# Altium schematic sheet LJ_Mosfet_Power.SchDoc
size 508 x 508 mm
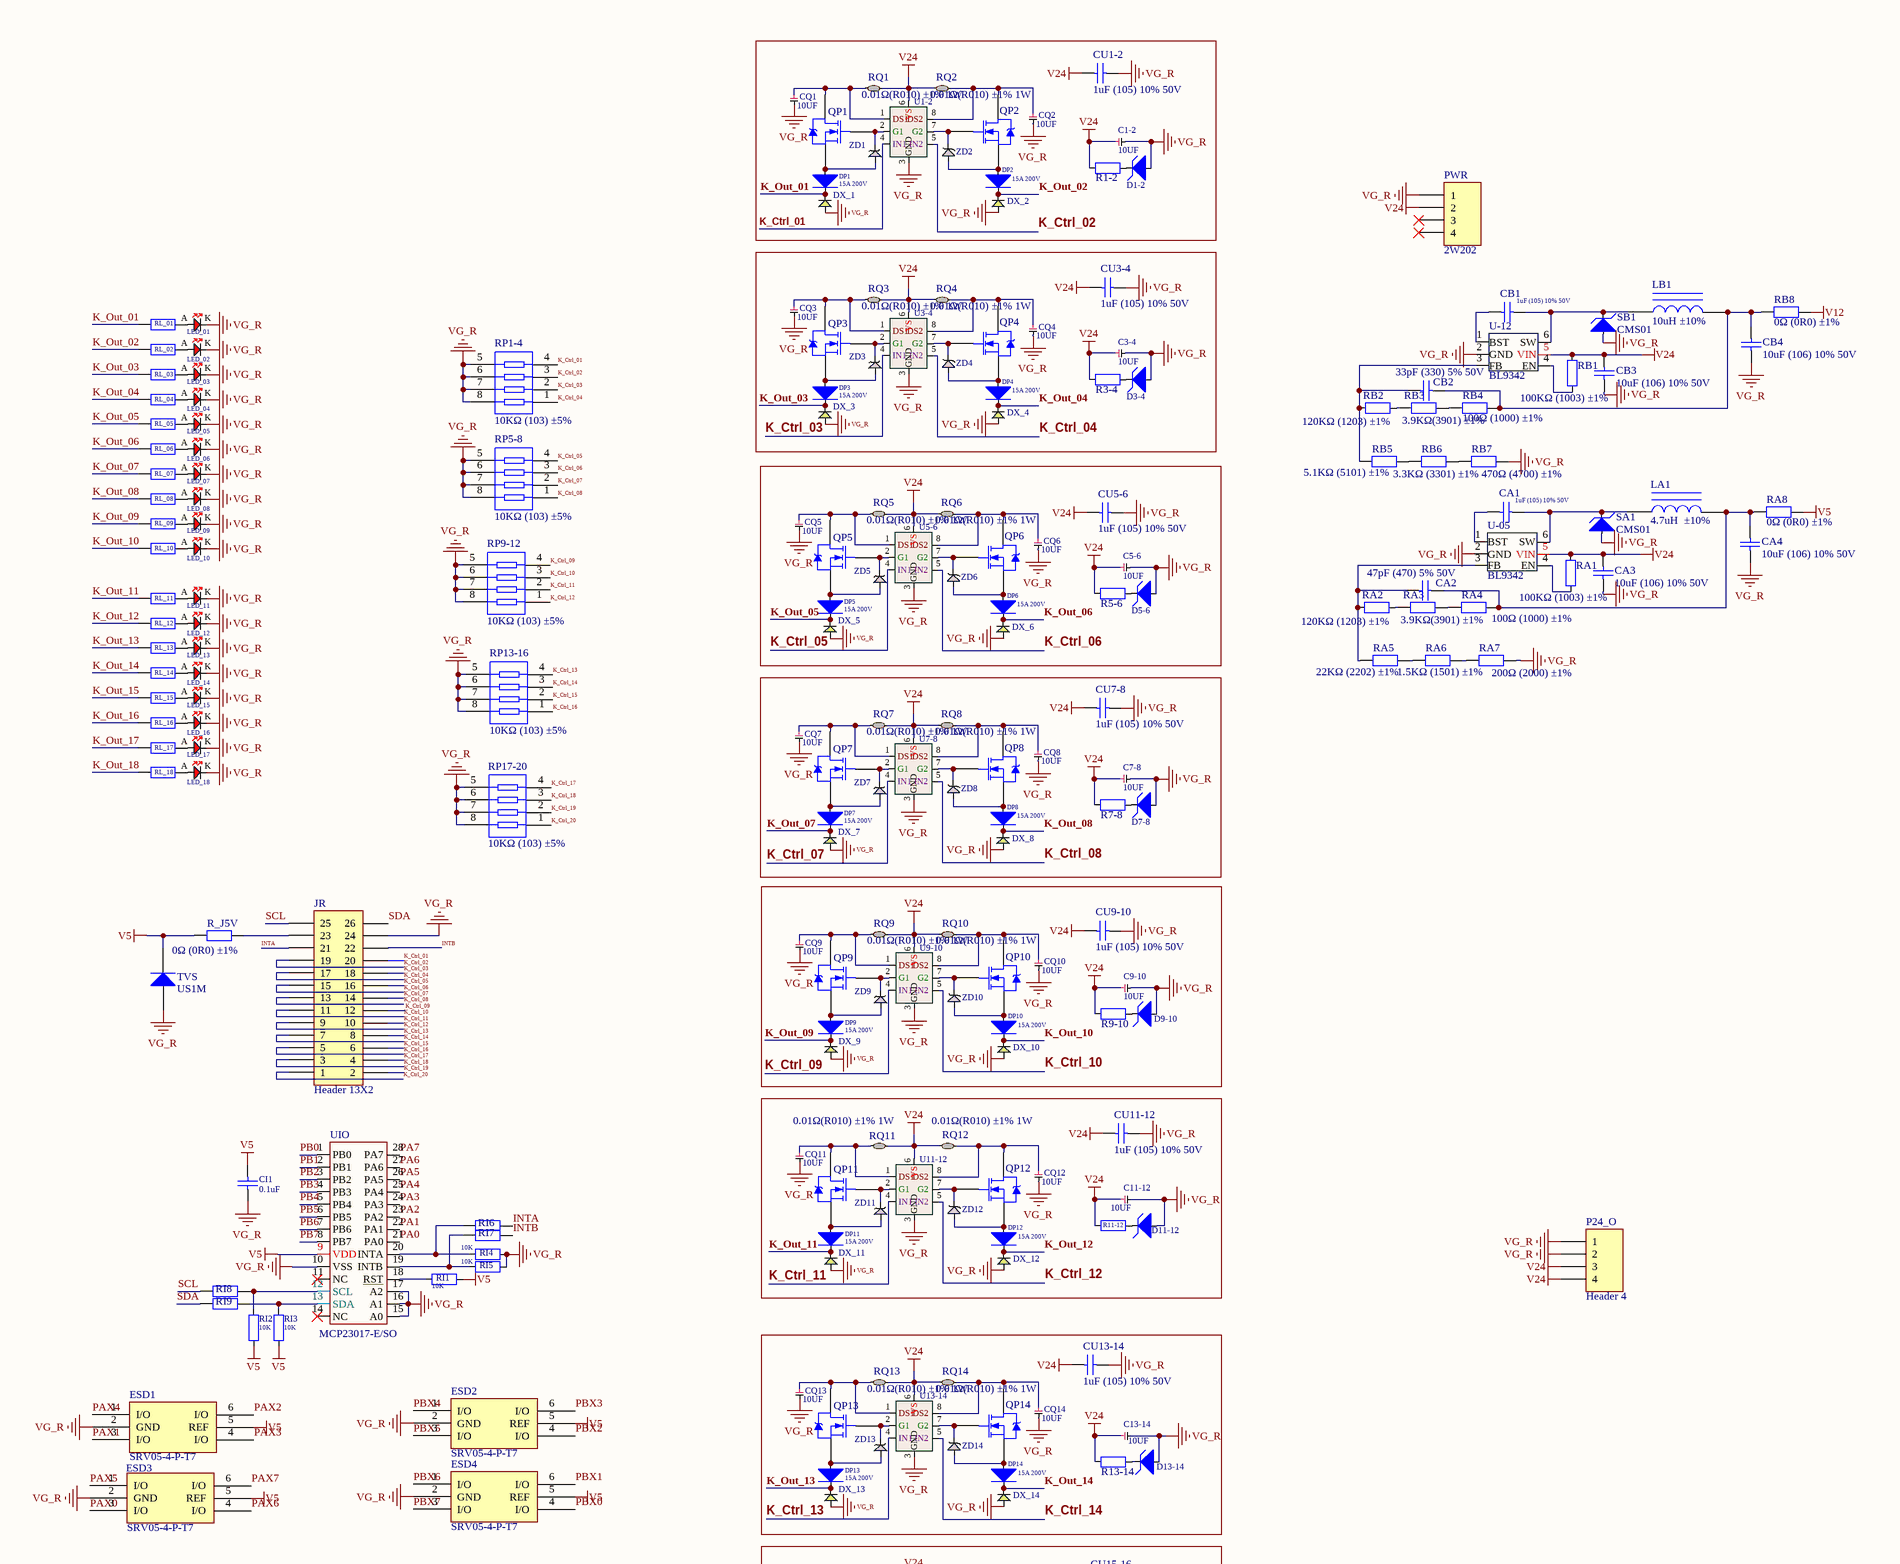
[diagram p0: LJ_Mosfet_Power.SchDoc, top left]
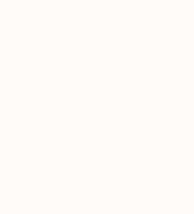
[diagram p1: LJ_Mosfet_Power.SchDoc, top right]
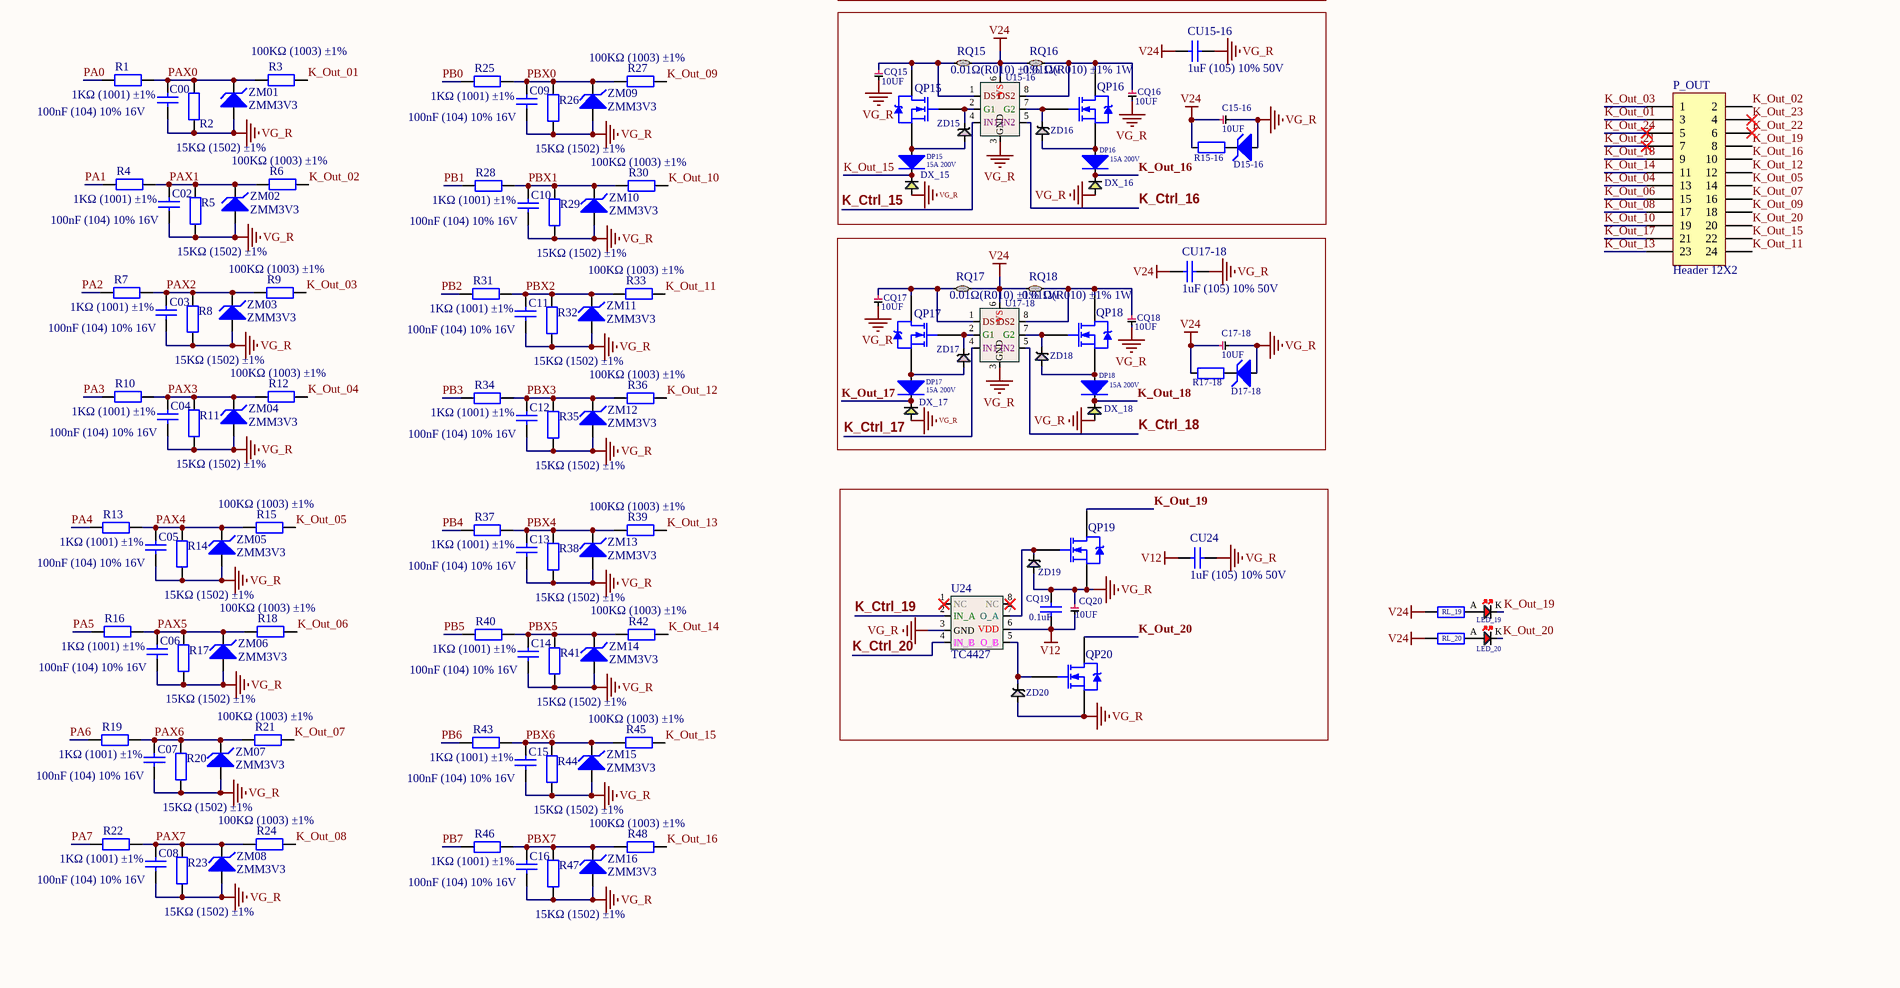
[diagram p2: LJ_Mosfet_Power.SchDoc, bottom left]
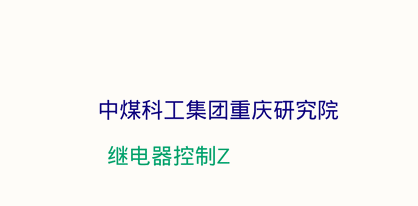
[diagram p3: LJ_Mosfet_Power.SchDoc, bottom right]

## Parts
C00  100nF (104) 10% 16V  [0402_C]
C1-2  10UF  [C1210]
C02  100nF (104) 10% 16V  [0402_C]
C03  100nF (104) 10% 16V  [0402_C]
C3-4  10UF  [C1210]
C04  100nF (104) 10% 16V  [0402_C]
C05  100nF (104) 10% 16V  [0402_C]
C5-6  10UF  [C1210]
C06  100nF (104) 10% 16V  [0402_C]
C07  100nF (104) 10% 16V  [0402_C]
C7-8  10UF  [C1210]
C08  100nF (104) 10% 16V  [0402_C]
C09  100nF (104) 10% 16V  [0402_C]
C9-10  10UF  [C1210]
C10  100nF (104) 10% 16V  [0402_C]
C11  100nF (104) 10% 16V  [0402_C]
C11-12  10UF  [C1210]
C12  100nF (104) 10% 16V  [0402_C]
C13  100nF (104) 10% 16V  [0402_C]
C13-14  10UF  [C1210]
C14  100nF (104) 10% 16V  [0402_C]
C15  100nF (104) 10% 16V  [0402_C]
C15-16  10UF  [C1210]
C16  100nF (104) 10% 16V  [0402_C]
C17-18  10UF  [C1210]
CA1  1uF (105) 10% 50V  [0603_C]
CA2  47pF (470) 5% 50V  [0402_C]
CA3  10uF (106) 10% 50V  [1206_C]
CA4  10uF (106) 10% 50V  [1206_C]
CB1  1uF (105) 10% 50V  [0603_C]
CB2  33pF (330) 5% 50V  [0402_C]
CB3  10uF (106) 10% 50V  [1206_C]
CB4  10uF (106) 10% 50V  [1206_C]
CI1  VAL: 0.1uF  [0603_C]  (hidden comment: 100nF (104) 10% 50V)
CQ1  10UF  [C1210]
CQ2  10UF  [C1210]
CQ3  10UF  [C1210]
CQ4  10UF  [C1210]
CQ5  10UF  [C1210]
CQ6  10UF  [C1210]
CQ7  10UF  [C1210]
CQ8  10UF  [C1210]
CQ9  10UF  [C1210]
CQ10  10UF  [C1210]
CQ11  10UF  [C1210]
CQ12  10UF  [C1210]
CQ13  10UF  [C1210]
CQ14  10UF  [C1210]
CQ15  10UF  [C1210]
CQ16  10UF  [C1210]
CQ17  10UF  [C1210]
CQ18  10UF  [C1210]
CQ19  VAL: 0.1uF  [0603_C]  (hidden comment: 100nF (104) 10% 50V)
CQ20  10UF  [C1210]
CU1-2  1uF (105) 10% 50V  [0805_C]
CU3-4  1uF (105) 10% 50V  [0805_C]
CU5-6  1uF (105) 10% 50V  [0805_C]
CU7-8  1uF (105) 10% 50V  [0805_C]
CU9-10  1uF (105) 10% 50V  [0805_C]
CU11-12  1uF (105) 10% 50V  [0805_C]
CU13-14  1uF (105) 10% 50V  [0805_C]
CU15-16  1uF (105) 10% 50V  [0805_C]
CU17-18  1uF (105) 10% 50V  [0805_C]
CU24  1uF (105) 10% 50V  [0805_C]
D1-2  ZMM5255B  [LL-34]  (value not drawn)
D3-4  ZMM5255B  [LL-34]  (value not drawn)
D5-6  ZMM5255B  [LL-34]  (value not drawn)
D7-8  ZMM5255B  [LL-34]  (value not drawn)
D9-10  ZMM5255B  [LL-34]  (value not drawn)
D11-12  ZMM5255B  [LL-34]  (value not drawn)
D13-14  ZMM5255B  [LL-34]  (value not drawn)
D15-16  ZMM5255B  [LL-34]  (value not drawn)
D17-18  ZMM5255B  [LL-34]  (value not drawn)
DP1  15A 200V  [TO-277B]
DP2  15A 200V  [TO-277B]
DP3  15A 200V  [TO-277B]
DP4  15A 200V  [TO-277B]
DP5  15A 200V  [TO-277B]
DP6  15A 200V  [TO-277B]
DP7  15A 200V  [TO-277B]
DP8  15A 200V  [TO-277B]
DP9  15A 200V  [TO-277B]
DP10  15A 200V  [TO-277B]
DP11  15A 200V  [TO-277B]
DP12  15A 200V  [TO-277B]
DP13  15A 200V  [TO-277B]
DP14  15A 200V  [TO-277B]
DP15  15A 200V  [TO-277B]
DP16  15A 200V  [TO-277B]
DP17  15A 200V  [TO-277B]
DP18  15A 200V  [TO-277B]
DX_1  US5M  [SMC]  (value not drawn)
DX_2  US5M  [SMC]  (value not drawn)
DX_3  US5M  [SMC]  (value not drawn)
DX_4  US5M  [SMC]  (value not drawn)
DX_5  US5M  [SMC]  (value not drawn)
DX_6  US5M  [SMC]  (value not drawn)
DX_7  US5M  [SMC]  (value not drawn)
DX_8  US5M  [SMC]  (value not drawn)
DX_9  US5M  [SMC]  (value not drawn)
DX_10  US5M  [SMC]  (value not drawn)
DX_11  US5M  [SMC]  (value not drawn)
DX_12  US5M  [SMC]  (value not drawn)
DX_13  US5M  [SMC]  (value not drawn)
DX_14  US5M  [SMC]  (value not drawn)
DX_15  US5M  [SMC]  (value not drawn)
DX_16  US5M  [SMC]  (value not drawn)
DX_17  US5M  [SMC]  (value not drawn)
DX_18  US5M  [SMC]  (value not drawn)
ESD1  SRV05-4-P-T7  [SOT23-6]
ESD2  SRV05-4-P-T7  [SOT23-6]
ESD3  SRV05-4-P-T7  [SOT23-6]
ESD4  SRV05-4-P-T7  [SOT23-6]
JR  Header 13X2  [FKV26HR]
LA1  4.7uH  ±10%  [1206_L]
LB1  10uH ±10%  [1206_L]
LED_01  红灯 0603  [0603_LED_S1]  (value not drawn)
LED_02  红灯 0603  [0603_LED_S1]  (value not drawn)
LED_03  红灯 0603  [0603_LED_S1]  (value not drawn)
LED_04  红灯 0603  [0603_LED_S1]  (value not drawn)
LED_05  红灯 0603  [0603_LED_S1]  (value not drawn)
LED_06  红灯 0603  [0603_LED_S1]  (value not drawn)
LED_07  红灯 0603  [0603_LED_S1]  (value not drawn)
LED_08  红灯 0603  [0603_LED_S1]  (value not drawn)
LED_09  红灯 0603  [0603_LED_S1]  (value not drawn)
LED_10  红灯 0603  [0603_LED_S1]  (value not drawn)
LED_11  红灯 0603  [0603_LED_S1]  (value not drawn)
LED_12  红灯 0603  [0603_LED_S1]  (value not drawn)
LED_13  红灯 0603  [0603_LED_S1]  (value not drawn)
LED_14  红灯 0603  [0603_LED_S1]  (value not drawn)
LED_15  红灯 0603  [0603_LED_S1]  (value not drawn)
LED_16  红灯 0603  [0603_LED_S1]  (value not drawn)
LED_17  红灯 0603  [0603_LED_S1]  (value not drawn)
LED_18  红灯 0603  [0603_LED_S1]  (value not drawn)
LED_19  红灯 0603  [0603_LED_S1]  (value not drawn)
LED_20  红灯 0603  [0603_LED_S1]  (value not drawn)
P24_O  Header 4  [KF235-5.0-4P]
P_OUT  Header 12X2  [5569_24P]
PWR  2W202  [2W2公90度带支架锁螺丝]
QP1  STB120NF10  [DPAK2 /to263]  (value not drawn)
QP2  STB120NF10  [DPAK2 /to263]  (value not drawn)
QP3  STB120NF10  [DPAK2 /to263]  (value not drawn)
QP4  STB120NF10  [DPAK2 /to263]  (value not drawn)
QP5  STB120NF10  [DPAK2 /to263]  (value not drawn)
QP6  STB120NF10  [DPAK2 /to263]  (value not drawn)
QP7  STB120NF10  [DPAK2 /to263]  (value not drawn)
QP8  STB120NF10  [DPAK2 /to263]  (value not drawn)
QP9  STB120NF10  [DPAK2 /to263]  (value not drawn)
QP10  STB120NF10  [DPAK2 /to263]  (value not drawn)
QP11  STB120NF10  [DPAK2 /to263]  (value not drawn)
QP12  STB120NF10  [DPAK2 /to263]  (value not drawn)
QP13  STB120NF10  [DPAK2 /to263]  (value not drawn)
QP14  STB120NF10  [DPAK2 /to263]  (value not drawn)
QP15  STB120NF10  [DPAK2 /to263]  (value not drawn)
QP16  STB120NF10  [DPAK2 /to263]  (value not drawn)
QP17  STB120NF10  [DPAK2 /to263]  (value not drawn)
QP18  STB120NF10  [DPAK2 /to263]  (value not drawn)
QP19  STB120NF10  [DPAK2 /to263]  (value not drawn)
QP20  STB120NF10  [DPAK2 /to263]  (value not drawn)
R1  1KΩ (1001) ±1%  [0402_R]
R1-2  1KΩ (1001) ±1%  [0805_R]  (value not drawn)
R2  15KΩ (1502) ±1%  [0402_R]
R3  100KΩ (1003) ±1%  [0402_R]
R3-4  1KΩ (1001) ±1%  [0805_R]  (value not drawn)
R4  1KΩ (1001) ±1%  [0402_R]
R5  15KΩ (1502) ±1%  [0402_R]
R5-6  1KΩ (1001) ±1%  [0805_R]  (value not drawn)
R6  100KΩ (1003) ±1%  [0402_R]
R7  1KΩ (1001) ±1%  [0402_R]
R7-8  1KΩ (1001) ±1%  [0805_R]  (value not drawn)
R8  15KΩ (1502) ±1%  [0402_R]
R9  100KΩ (1003) ±1%  [0402_R]
R9-10  1KΩ (1001) ±1%  [0805_R]  (value not drawn)
R10  1KΩ (1001) ±1%  [0402_R]
R11  15KΩ (1502) ±1%  [0402_R]
R11-12  1KΩ (1001) ±1%  [0805_R]  (value not drawn)
R12  100KΩ (1003) ±1%  [0402_R]
R13  1KΩ (1001) ±1%  [0402_R]
R13-14  1KΩ (1001) ±1%  [0805_R]  (value not drawn)
R14  15KΩ (1502) ±1%  [0402_R]
R15  100KΩ (1003) ±1%  [0402_R]
R15-16  1KΩ (1001) ±1%  [0805_R]  (value not drawn)
R16  1KΩ (1001) ±1%  [0402_R]
R17  15KΩ (1502) ±1%  [0402_R]
R17-18  1KΩ (1001) ±1%  [0805_R]  (value not drawn)
R18  100KΩ (1003) ±1%  [0402_R]
R19  1KΩ (1001) ±1%  [0402_R]
R20  15KΩ (1502) ±1%  [0402_R]
R21  100KΩ (1003) ±1%  [0402_R]
R22  1KΩ (1001) ±1%  [0402_R]
R23  15KΩ (1502) ±1%  [0402_R]
R24  100KΩ (1003) ±1%  [0402_R]
R25  1KΩ (1001) ±1%  [0402_R]
R26  15KΩ (1502) ±1%  [0402_R]
R27  100KΩ (1003) ±1%  [0402_R]
R28  1KΩ (1001) ±1%  [0402_R]
R29  15KΩ (1502) ±1%  [0402_R]
R30  100KΩ (1003) ±1%  [0402_R]
R31  1KΩ (1001) ±1%  [0402_R]
R32  15KΩ (1502) ±1%  [0402_R]
R33  100KΩ (1003) ±1%  [0402_R]
R34  1KΩ (1001) ±1%  [0402_R]
R35  15KΩ (1502) ±1%  [0402_R]
R36  100KΩ (1003) ±1%  [0402_R]
R37  1KΩ (1001) ±1%  [0402_R]
R38  15KΩ (1502) ±1%  [0402_R]
R39  100KΩ (1003) ±1%  [0402_R]
R40  1KΩ (1001) ±1%  [0402_R]
R41  15KΩ (1502) ±1%  [0402_R]
R42  100KΩ (1003) ±1%  [0402_R]
R43  1KΩ (1001) ±1%  [0402_R]
R44  15KΩ (1502) ±1%  [0402_R]
R45  100KΩ (1003) ±1%  [0402_R]
R46  1KΩ (1001) ±1%  [0402_R]
R47  15KΩ (1502) ±1%  [0402_R]
R48  100KΩ (1003) ±1%  [0402_R]
R_J5V  0Ω (0R0) ±1%  [0805_R]
RA1  100KΩ (1003) ±1%  [0402_R]
RA2  120KΩ (1203) ±1%  [0402_R]
RA3  3.9KΩ(3901) ±1%  [0402_R]
RA4  100Ω (1000) ±1%  [0402_R]
RA5  22KΩ (2202) ±1%  [0402_R]
RA6  1.5KΩ (1501) ±1%  [0402_R]
RA7  200Ω (2000) ±1%  [0402_R]
RA8  0Ω (0R0) ±1%  [0805_R]
RB1  100KΩ (1003) ±1%  [0402_R]
RB2  120KΩ (1203) ±1%  [0402_R]
RB3  3.9KΩ(3901) ±1%  [0402_R]
RB4  100Ω (1000) ±1%  [0402_R]
RB5  5.1KΩ (5101) ±1%  [0402_R]
RB6  3.3KΩ (3301) ±1%  [0402_R]
RB7  470Ω (4700) ±1%  [0402_R]
RB8  0Ω (0R0) ±1%  [0805_R]
RI1  VAL: 10K  [0402_R]  (hidden comment: 10KΩ (1002) ±1%)
RI2  VAL: 10K  [0402_R]  (hidden comment: 10KΩ (1002) ±1%)
RI3  VAL: 10K  [0402_R]  (hidden comment: 10KΩ (1002) ±1%)
RI4  VAL: 10K  [0402_R]  (hidden comment: 10KΩ (1002) ±1%)
RI5  VAL: 10K  [0402_R]  (hidden comment: 10KΩ (1002) ±1%)
RI6  0Ω (0R0) ±1%  [0402_R]  (value not drawn)
RI7  0Ω (0R0) ±1%  [0402_R]  (value not drawn)
RI8  0Ω (0R0) ±1%  [0402_R]  (value not drawn)
RI9  0Ω (0R0) ±1%  [0402_R]  (value not drawn)
RL_01  20KΩ (2002) ±1%  [0603_R]  (value not drawn)
RL_02  20KΩ (2002) ±1%  [0603_R]  (value not drawn)
RL_03  20KΩ (2002) ±1%  [0603_R]  (value not drawn)
RL_04  20KΩ (2002) ±1%  [0603_R]  (value not drawn)
RL_05  20KΩ (2002) ±1%  [0603_R]  (value not drawn)
RL_06  20KΩ (2002) ±1%  [0603_R]  (value not drawn)
RL_07  20KΩ (2002) ±1%  [0603_R]  (value not drawn)
RL_08  20KΩ (2002) ±1%  [0603_R]  (value not drawn)
RL_09  20KΩ (2002) ±1%  [0603_R]  (value not drawn)
RL_10  20KΩ (2002) ±1%  [0603_R]  (value not drawn)
RL_11  20KΩ (2002) ±1%  [0603_R]  (value not drawn)
RL_12  20KΩ (2002) ±1%  [0603_R]  (value not drawn)
RL_13  20KΩ (2002) ±1%  [0603_R]  (value not drawn)
RL_14  20KΩ (2002) ±1%  [0603_R]  (value not drawn)
RL_15  20KΩ (2002) ±1%  [0603_R]  (value not drawn)
RL_16  20KΩ (2002) ±1%  [0603_R]  (value not drawn)
RL_17  20KΩ (2002) ±1%  [0603_R]  (value not drawn)
RL_18  20KΩ (2002) ±1%  [0603_R]  (value not drawn)
RL_19  20KΩ (2002) ±1%  [0603_R]  (value not drawn)
RL_20  20KΩ (2002) ±1%  [0603_R]  (value not drawn)
RP1-4  10KΩ (103) ±5%  [0603_Rx4]
RP5-8  10KΩ (103) ±5%  [0603_Rx4]
RP9-12  10KΩ (103) ±5%  [0603_Rx4]
RP13-16  10KΩ (103) ±5%  [0603_Rx4]
RP17-20  10KΩ (103) ±5%  [0603_Rx4]
RQ1  0.01Ω(R010) ±1% 1W  [R2512]
RQ2  0.01Ω(R010) ±1% 1W  [R2512]
RQ3  0.01Ω(R010) ±1% 1W  [R2512]
RQ4  0.01Ω(R010) ±1% 1W  [R2512]
RQ5  0.01Ω(R010) ±1% 1W  [R2512]
RQ6  0.01Ω(R010) ±1% 1W  [R2512]
RQ7  0.01Ω(R010) ±1% 1W  [R2512]
RQ8  0.01Ω(R010) ±1% 1W  [R2512]
RQ9  0.01Ω(R010) ±1% 1W  [R2512]
RQ10  0.01Ω(R010) ±1% 1W  [R2512]
RQ11  0.01Ω(R010) ±1% 1W  [R2512]
RQ12  0.01Ω(R010) ±1% 1W  [R2512]
RQ13  0.01Ω(R010) ±1% 1W  [R2512]
RQ14  0.01Ω(R010) ±1% 1W  [R2512]
RQ15  0.01Ω(R010) ±1% 1W  [R2512]
RQ16  0.01Ω(R010) ±1% 1W  [R2512]
RQ17  0.01Ω(R010) ±1% 1W  [R2512]
RQ18  0.01Ω(R010) ±1% 1W  [R2512]
SA1  CMS01  [M-FLAT]
SB1  CMS01  [M-FLAT]
TVS  US1M  [SMA(DO-214AC)_S1]
U1-2  LTC1255CS8  [LC-SOIC-8_150mil]  (value not drawn)
U3-4  LTC1255CS8  [LC-SOIC-8_150mil]  (value not drawn)
U5-6  LTC1255CS8  [LC-SOIC-8_150mil]  (value not drawn)
U7-8  LTC1255CS8  [LC-SOIC-8_150mil]  (value not drawn)
U9-10  LTC1255CS8  [LC-SOIC-8_150mil]  (value not drawn)
U11-12  LTC1255CS8  [LC-SOIC-8_150mil]  (value not drawn)
U13-14  LTC1255CS8  [LC-SOIC-8_150mil]  (value not drawn)
U15-16  LTC1255CS8  [LC-SOIC-8_150mil]  (value not drawn)
U17-18  LTC1255CS8  [LC-SOIC-8_150mil]  (value not drawn)
U24  TC4427  [SOIC8]
U-05  BL9342  [SOT23-6]
U-12  BL9342  [SOT23-6]
UIO  MCP23017-E/SO  [SSOP28]
ZD1  LBZT52C12T1G  [SOD123]  (value not drawn)
ZD2  LBZT52C12T1G  [SOD123]  (value not drawn)
ZD3  LBZT52C12T1G  [SOD123]  (value not drawn)
ZD4  LBZT52C12T1G  [SOD123]  (value not drawn)
ZD5  LBZT52C12T1G  [SOD123]  (value not drawn)
ZD6  LBZT52C12T1G  [SOD123]  (value not drawn)
ZD7  LBZT52C12T1G  [SOD123]  (value not drawn)
ZD8  LBZT52C12T1G  [SOD123]  (value not drawn)
ZD9  LBZT52C12T1G  [SOD123]  (value not drawn)
ZD10  LBZT52C12T1G  [SOD123]  (value not drawn)
ZD11  LBZT52C12T1G  [SOD123]  (value not drawn)
ZD12  LBZT52C12T1G  [SOD123]  (value not drawn)
ZD13  LBZT52C12T1G  [SOD123]  (value not drawn)
ZD14  LBZT52C12T1G  [SOD123]  (value not drawn)
ZD15  LBZT52C12T1G  [SOD123]  (value not drawn)
ZD16  LBZT52C12T1G  [SOD123]  (value not drawn)
ZD17  LBZT52C12T1G  [SOD123]  (value not drawn)
ZD18  LBZT52C12T1G  [SOD123]  (value not drawn)
ZD19  LBZT52C12T1G  [SOD123]  (value not drawn)
ZD20  LBZT52C12T1G  [SOD123]  (value not drawn)
ZM01  ZMM3V3  [LL-34]
ZM02  ZMM3V3  [LL-34]
ZM03  ZMM3V3  [LL-34]
ZM04  ZMM3V3  [LL-34]
ZM05  ZMM3V3  [LL-34]
ZM06  ZMM3V3  [LL-34]
ZM07  ZMM3V3  [LL-34]
ZM08  ZMM3V3  [LL-34]
ZM09  ZMM3V3  [LL-34]
ZM10  ZMM3V3  [LL-34]
ZM11  ZMM3V3  [LL-34]
ZM12  ZMM3V3  [LL-34]
ZM13  ZMM3V3  [LL-34]
ZM14  ZMM3V3  [LL-34]
ZM15  ZMM3V3  [LL-34]
ZM16  ZMM3V3  [LL-34]

## Nets
V5: CI1.2 ESD1.5(REF) ESD2.5(REF) ESD3.5(REF) ESD4.5(REF) R_J5V.1 RA8.2 RI1.2 RI2.2 RI3.2 TVS.2(K) UIO.9(VDD)
V12: CQ19.1 CQ20.2 CU24.1 RB8.2 U24.6(VDD)
V24: C1-2.1 C3-4.1 C5-6.1 C7-8.1 C9-10.1 C11-12.1 C13-14.1 C15-16.1 C17-18.1 CA3.2 CB3.2 CU1-2.1 CU3-4.1 CU5-6.1 CU7-8.1 CU9-10.1 CU11-12.1 CU13-14.1 CU15-16.1 CU17-18.1 P24_O.3 P24_O.4 PWR.2 R1-2.1 R3-4.1 R5-6.1 R7-8.1 R9-10.1 R11-12.1 R13-14.1 R15-16.1 R17-18.1 RA1.2 RB1.2 RL_19.2 RL_20.2 RQ1.2 RQ2.1 RQ3.2 RQ4.1 RQ5.2 RQ6.1 RQ7.2 RQ8.1 RQ9.2 RQ10.1 RQ11.2 RQ12.1 RQ13.2 RQ14.1 RQ15.2 RQ16.1 RQ17.2 RQ18.1 U1-2.6(VS) U3-4.6(VS) U5-6.6(VS) U7-8.6(VS) U9-10.6(VS) U11-12.6(VS) U13-14.6(VS) U15-16.6(VS) U17-18.6(VS) U-05.5(VIN) U-12.5(VIN)
VG_R: C00.1 C1-2.2 C02.1 C03.1 C3-4.2 C04.1 C05.1 C5-6.2 C06.1 C07.1 C7-8.2 C08.1 C09.1 C9-10.2 C10.1 C11.1 C11-12.2 C12.1 C13.1 C13-14.2 C14.1 C15.1 C15-16.2 C16.1 C17-18.2 CA3.1 CA4.2 CB3.1 CB4.2 CI1.1 CQ1.2 CQ2.2 CQ3.2 CQ4.2 CQ5.2 CQ6.2 CQ7.2 CQ8.2 CQ9.2 CQ10.2 CQ11.2 CQ12.2 CQ13.2 CQ14.2 CQ15.2 CQ16.2 CQ17.2 CQ18.2 CQ19.2 CQ20.1 CU1-2.2 CU3-4.2 CU5-6.2 CU7-8.2 CU9-10.2 CU11-12.2 CU13-14.2 CU15-16.2 CU17-18.2 CU24.2 D1-2.1(A) D3-4.1(A) D5-6.1(A) D7-8.1(A) D9-10.1(A) D11-12.1(A) D13-14.1(A) D15-16.1(A) D17-18.1(A) DX_1.1 DX_2.1 DX_3.1 DX_4.1 DX_5.1 DX_6.1 DX_7.1 DX_8.1 DX_9.1 DX_10.1 DX_11.1 DX_12.1 DX_13.1 DX_14.1 DX_15.1 DX_16.1 DX_17.1 DX_18.1 ESD1.2(GND) ESD2.2(GND) ESD3.2(GND) ESD4.2(GND) JR.24 LED_01.K LED_02.K LED_03.K LED_04.K LED_05.K LED_06.K LED_07.K LED_08.K LED_09.K LED_10.K LED_11.K LED_12.K LED_13.K LED_14.K LED_15.K LED_16.K LED_17.K LED_18.K P24_O.1 P24_O.2 PWR.1 QP19.3(S) QP20.3(S) R2.1 R5.1 R8.1 R11.1 R14.1 R17.1 R20.1 R23.1 R26.1 R29.1 R32.1 R35.1 R38.1 R41.1 R44.1 R47.1 RA7.2 RB7.2 RI4.2 RI5.2 RP1-4.5 RP1-4.6 RP1-4.7 RP1-4.8 RP5-8.5 RP5-8.6 RP5-8.7 RP5-8.8 RP9-12.5 RP9-12.6 RP9-12.7 RP9-12.8 RP13-16.5 RP13-16.6 RP13-16.7 RP13-16.8 RP17-20.5 RP17-20.6 RP17-20.7 RP17-20.8 SA1.1(A) SB1.1(A) TVS.1(A) U1-2.3(GND) U3-4.3(GND) U5-6.3(GND) U7-8.3(GND) U9-10.3(GND) U11-12.3(GND) U13-14.3(GND) U15-16.3(GND) U17-18.3(GND) U24.3(GND) U-05.2(GND) U-12.2(GND) UIO.10(VSS) UIO.15(A0) UIO.16(A1) UIO.17(A2) ZD19.1 ZD20.1 ZM01.1(A) ZM02.1(A) ZM03.1(A) ZM04.1(A) ZM05.1(A) ZM06.1(A) ZM07.1(A) ZM08.1(A) ZM09.1(A) ZM10.1(A) ZM11.1(A) ZM12.1(A) ZM13.1(A) ZM14.1(A) ZM15.1(A) ZM16.1(A)
INTA: JR.21 RI6.2
INTB: JR.22 RI7.2
K_Ctrl_01: JR.20 RP1-4.4 U1-2.4(IN1)
K_Ctrl_02: JR.19 RP1-4.3 U1-2.5(IN2)
K_Ctrl_03: JR.18 RP1-4.2 U3-4.4(IN1)
K_Ctrl_04: JR.17 RP1-4.1 U3-4.5(IN2)
K_Ctrl_05: JR.16 RP5-8.4 U5-6.4(IN1)
K_Ctrl_06: JR.15 RP5-8.3 U5-6.5(IN2)
K_Ctrl_07: JR.14 RP5-8.2 U7-8.4(IN1)
K_Ctrl_08: JR.13 RP5-8.1 U7-8.5(IN2)
K_Ctrl_09: JR.12 RP9-12.4 U9-10.4(IN1)
K_Ctrl_10: JR.11 RP9-12.3 U9-10.5(IN2)
K_Ctrl_11: JR.10 RP9-12.2 U11-12.4(IN1)
K_Ctrl_12: JR.9 RP9-12.1 U11-12.5(IN2)
K_Ctrl_13: JR.8 RP13-16.4 U13-14.4(IN1)
K_Ctrl_14: JR.7 RP13-16.3 U13-14.5(IN2)
K_Ctrl_15: JR.6 RP13-16.2 U15-16.4(IN1)
K_Ctrl_16: JR.5 RP13-16.1 U15-16.5(IN2)
K_Ctrl_17: JR.4 RP17-20.4 U17-18.4(IN1)
K_Ctrl_18: JR.3 RP17-20.3 U17-18.5(IN2)
K_Ctrl_19: JR.2 RP17-20.2 U24.2(IN_A)
K_Ctrl_20: JR.1 RP17-20.1 U24.4(IN_B)
K_Out_01: DP1.2(K) DX_1.2 P_OUT.3 R3.2 RL_01.2
K_Out_02: DP2.2(K) DX_2.2 P_OUT.2 R6.2 RL_02.2
K_Out_03: DP3.2(K) DX_3.2 P_OUT.1 R9.2 RL_03.2
K_Out_04: DP4.2(K) DX_4.2 P_OUT.13 R12.2 RL_04.2
K_Out_05: DP5.2(K) DX_5.2 P_OUT.14 R15.2 RL_05.2
K_Out_06: DP6.2(K) DX_6.2 P_OUT.15 R18.2 RL_06.2
K_Out_07: DP7.2(K) DX_7.2 P_OUT.16 R21.2 RL_07.2
K_Out_08: DP8.2(K) DX_8.2 P_OUT.17 R24.2 RL_08.2
K_Out_09: DP9.2(K) DX_9.2 P_OUT.18 R27.2 RL_09.2
K_Out_10: DP10.2(K) DX_10.2 P_OUT.19 R30.2 RL_10.2
K_Out_11: DP11.2(K) DX_11.2 P_OUT.24 R33.2 RL_11.2
K_Out_12: DP12.2(K) DX_12.2 P_OUT.12 R36.2 RL_12.2
K_Out_13: DP13.2(K) DX_13.2 P_OUT.23 R39.2 RL_13.2
K_Out_14: DP14.2(K) DX_14.2 P_OUT.11 R42.2 RL_14.2
K_Out_15: DP15.2(K) DX_15.2 P_OUT.22 R45.2 RL_15.2
K_Out_16: DP16.2(K) DX_16.2 P_OUT.10 R48.2 RL_16.2
K_Out_17: DP17.2(K) DX_17.2 P_OUT.21 RL_17.2
K_Out_18: DP18.2(K) DX_18.2 P_OUT.9 RL_18.2
K_Out_19: LED_19.K P_OUT.8 QP19.2(D)
K_Out_20: LED_20.K P_OUT.20 QP20.2(D)
K_Out_21: P_OUT.7
K_Out_22: P_OUT.6
K_Out_23: P_OUT.4
K_Out_24: P_OUT.5
PA0: R1.1 UIO.21(PA0)
PA1: R4.1 UIO.22(PA1)
PA2: R7.1 UIO.23(PA2)
PA3: R10.1 UIO.24(PA3)
PA4: R13.1 UIO.25(PA4)
PA5: R16.1 UIO.26(PA5)
PA6: R19.1 UIO.27(PA6)
PA7: R22.1 UIO.28(PA7)
PAX0: C00.2 ESD3.3(I/O) R1.2 R2.2 R3.1 ZM01.2(K)
PAX1: C02.2 ESD1.3(I/O) R4.2 R5.2 R6.1 ZM02.2(K)
PAX2: C03.2 ESD1.6(I/O) R7.2 R8.2 R9.1 ZM03.2(K)
PAX3: C04.2 ESD1.4(I/O) R10.2 R11.2 R12.1 ZM04.2(K)
PAX4: C05.2 ESD1.1(I/O) R13.2 R14.2 R15.1 ZM05.2(K)
PAX5: C06.2 ESD3.1(I/O) R16.2 R17.2 R18.1 ZM06.2(K)
PAX6: C07.2 ESD3.4(I/O) R19.2 R20.2 R21.1 ZM07.2(K)
PAX7: C08.2 ESD3.6(I/O) R22.2 R23.2 R24.1 ZM08.2(K)
PB0: R25.1 UIO.1(PB0)
PB1: R28.1 UIO.2(PB1)
PB2: R31.1 UIO.3(PB2)
PB3: R34.1 UIO.4(PB3)
PB4: R37.1 UIO.5(PB4)
PB5: R40.1 UIO.6(PB5)
PB6: R43.1 UIO.7(PB6)
PB7: R46.1 UIO.8(PB7)
PBX0: C09.2 ESD4.4(I/O) R25.2 R26.2 R27.1 ZM09.2(K)
PBX1: C10.2 ESD4.6(I/O) R28.2 R29.2 R30.1 ZM10.2(K)
PBX2: C11.2 ESD2.4(I/O) R31.2 R32.2 R33.1 ZM11.2(K)
PBX3: C12.2 ESD2.6(I/O) R34.2 R35.2 R36.1 ZM12.2(K)
PBX4: C13.2 ESD2.1(I/O) R37.2 R38.2 R39.1 ZM13.2(K)
PBX5: C14.2 ESD2.3(I/O) R40.2 R41.2 R42.1 ZM14.2(K)
PBX6: C15.2 ESD4.1(I/O) R43.2 R44.2 R45.1 ZM15.2(K)
PBX7: C16.2 ESD4.3(I/O) R46.2 R47.2 R48.1 ZM16.2(K)
SCL: JR.25 RI8.1
SDA: JR.26 RI9.1
NetCA1_1: CA1.1 U-05.1(BST)
NetCA1_2: CA1.2 LA1.1 SA1.2(K) U-05.6(SW)
NetCA2_1: CA2.1 RA2.1 RA5.1 U-05.3(FB)
NetCA2_2: CA2.2 CA4.1 LA1.2 RA4.2 RA8.1
NetCB1_1: CB1.1 U-12.1(BST)
NetCB1_2: CB1.2 LB1.1 SB1.2(K) U-12.6(SW)
NetCB2_1: CB2.1 RB2.1 RB5.1 U-12.3(FB)
NetCB2_2: CB2.2 CB4.1 LB1.2 RB4.2 RB8.1
NetCQ1_1: CQ1.1 QP1.2(D) RQ1.1 U1-2.1(DS1)
NetCQ2_1: CQ2.1 QP2.2(D) RQ2.2 U1-2.8(DS2)
NetCQ3_1: CQ3.1 QP3.2(D) RQ3.1 U3-4.1(DS1)
NetCQ4_1: CQ4.1 QP4.2(D) RQ4.2 U3-4.8(DS2)
NetCQ5_1: CQ5.1 QP5.2(D) RQ5.1 U5-6.1(DS1)
NetCQ6_1: CQ6.1 QP6.2(D) RQ6.2 U5-6.8(DS2)
NetCQ7_1: CQ7.1 QP7.2(D) RQ7.1 U7-8.1(DS1)
NetCQ8_1: CQ8.1 QP8.2(D) RQ8.2 U7-8.8(DS2)
NetCQ9_1: CQ9.1 QP9.2(D) RQ9.1 U9-10.1(DS1)
NetCQ10_1: CQ10.1 QP10.2(D) RQ10.2 U9-10.8(DS2)
NetCQ11_1: CQ11.1 QP11.2(D) RQ11.1 U11-12.1(DS1)
NetCQ12_1: CQ12.1 QP12.2(D) RQ12.2 U11-12.8(DS2)
NetCQ13_1: CQ13.1 QP13.2(D) RQ13.1 U13-14.1(DS1)
NetCQ14_1: CQ14.1 QP14.2(D) RQ14.2 U13-14.8(DS2)
NetCQ15_1: CQ15.1 QP15.2(D) RQ15.1 U15-16.1(DS1)
NetCQ16_1: CQ16.1 QP16.2(D) RQ16.2 U15-16.8(DS2)
NetCQ17_1: CQ17.1 QP17.2(D) RQ17.1 U17-18.1(DS1)
NetCQ18_1: CQ18.1 QP18.2(D) RQ18.2 U17-18.8(DS2)
NetD1-2_2: D1-2.2(K) R1-2.2
NetD3-4_2: D3-4.2(K) R3-4.2
NetD5-6_2: D5-6.2(K) R5-6.2
NetD7-8_2: D7-8.2(K) R7-8.2
NetD9-10_2: D9-10.2(K) R9-10.2
NetD11-12_2: D11-12.2(K) R11-12.2
NetD13-14_2: D13-14.2(K) R13-14.2
NetD15-16_2: D15-16.2(K) R15-16.2
NetD17-18_2: D17-18.2(K) R17-18.2
NetDP1_1: DP1.1(A) QP1.3(S) ZD1.1
NetDP2_1: DP2.1(A) QP2.3(S) ZD2.1
NetDP3_1: DP3.1(A) QP3.3(S) ZD3.1
NetDP4_1: DP4.1(A) QP4.3(S) ZD4.1
NetDP5_1: DP5.1(A) QP5.3(S) ZD5.1
NetDP6_1: DP6.1(A) QP6.3(S) ZD6.1
NetDP7_1: DP7.1(A) QP7.3(S) ZD7.1
NetDP8_1: DP8.1(A) QP8.3(S) ZD8.1
NetDP9_1: DP9.1(A) QP9.3(S) ZD9.1
NetDP10_1: DP10.1(A) QP10.3(S) ZD10.1
NetDP11_1: DP11.1(A) QP11.3(S) ZD11.1
NetDP12_1: DP12.1(A) QP12.3(S) ZD12.1
NetDP13_1: DP13.1(A) QP13.3(S) ZD13.1
NetDP14_1: DP14.1(A) QP14.3(S) ZD14.1
NetDP15_1: DP15.1(A) QP15.3(S) ZD15.1
NetDP16_1: DP16.1(A) QP16.3(S) ZD16.1
NetDP17_1: DP17.1(A) QP17.3(S) ZD17.1
NetDP18_1: DP18.1(A) QP18.3(S) ZD18.1
NetJR_23: JR.23 R_J5V.2
NetLED_01_A: LED_01.A RL_01.1
NetLED_02_A: LED_02.A RL_02.1
NetLED_03_A: LED_03.A RL_03.1
NetLED_04_A: LED_04.A RL_04.1
NetLED_05_A: LED_05.A RL_05.1
NetLED_06_A: LED_06.A RL_06.1
NetLED_07_A: LED_07.A RL_07.1
NetLED_08_A: LED_08.A RL_08.1
NetLED_09_A: LED_09.A RL_09.1
NetLED_10_A: LED_10.A RL_10.1
NetLED_11_A: LED_11.A RL_11.1
NetLED_12_A: LED_12.A RL_12.1
NetLED_13_A: LED_13.A RL_13.1
NetLED_14_A: LED_14.A RL_14.1
NetLED_15_A: LED_15.A RL_15.1
NetLED_16_A: LED_16.A RL_16.1
NetLED_17_A: LED_17.A RL_17.1
NetLED_18_A: LED_18.A RL_18.1
NetLED_19_A: LED_19.A RL_19.1
NetLED_20_A: LED_20.A RL_20.1
NetQP1_1: QP1.1(G) U1-2.2(G1) ZD1.2
NetQP2_1: QP2.1(G) U1-2.7(G2) ZD2.2
NetQP3_1: QP3.1(G) U3-4.2(G1) ZD3.2
NetQP4_1: QP4.1(G) U3-4.7(G2) ZD4.2
NetQP5_1: QP5.1(G) U5-6.2(G1) ZD5.2
NetQP6_1: QP6.1(G) U5-6.7(G2) ZD6.2
NetQP7_1: QP7.1(G) U7-8.2(G1) ZD7.2
NetQP8_1: QP8.1(G) U7-8.7(G2) ZD8.2
NetQP9_1: QP9.1(G) U9-10.2(G1) ZD9.2
NetQP10_1: QP10.1(G) U9-10.7(G2) ZD10.2
NetQP11_1: QP11.1(G) U11-12.2(G1) ZD11.2
NetQP12_1: QP12.1(G) U11-12.7(G2) ZD12.2
NetQP13_1: QP13.1(G) U13-14.2(G1) ZD13.2
NetQP14_1: QP14.1(G) U13-14.7(G2) ZD14.2
NetQP15_1: QP15.1(G) U15-16.2(G1) ZD15.2
NetQP16_1: QP16.1(G) U15-16.7(G2) ZD16.2
NetQP17_1: QP17.1(G) U17-18.2(G1) ZD17.2
NetQP18_1: QP18.1(G) U17-18.7(G2) ZD18.2
NetQP19_1: QP19.1(G) U24.7(O_A) ZD19.2
NetQP20_1: QP20.1(G) U24.5(O_B) ZD20.2
NetRA1_1: RA1.1 U-05.4(EN)
NetRA2_2: RA2.2 RA3.1
NetRA3_2: RA3.2 RA4.1
NetRA5_2: RA5.2 RA6.1
NetRA6_2: RA6.2 RA7.1
NetRB1_1: RB1.1 U-12.4(EN)
NetRB2_2: RB2.2 RB3.1
NetRB3_2: RB3.2 RB4.1
NetRB5_2: RB5.2 RB6.1
NetRB6_2: RB6.2 RB7.1
NetRI1_1: RI1.1 UIO.18(RST)
NetRI2_1: RI2.1 RI8.2 UIO.12(SCL)
NetRI3_1: RI3.1 RI9.2 UIO.13(SDA)
NetRI4_1: RI4.1 RI6.1 UIO.20(INTA)
NetRI5_1: RI5.1 RI7.1 UIO.19(INTB)

Not connected (* = marked no-connect by the designer): PWR 3* 4*; U24 1(NC)* 8(NC)*; UIO 11(NC)* 14(NC)*

## Notes on the sheet
- 中煤科工集团重庆研究院
- 继电器控制Z

## Library data of the parts
C00 C02 C03 C04 C05 C06 C07 C08 C09-C16 = 0402 100nF (104) 10% 16V: 贴片电容; ComponentLink1Description: 供应商链接; ComponentLink1URL: http://www.szlcsc.com/product/details_1877.html; Package: 0402; Supplier: LC; SuppliersPartNumber: C1525
C1-2 C3-4 C5-6 C7-8 C9-10 C11-12 C13-14 C15-16 C17-18 CQ20 = C: 贴片电容; VAL: 贴片电容10UF 100V 1210 106K 10% X7R 无极性电容10UF C3225陶瓷; VAL: TDK贴片电容10UF 50V/100V 1812 106K 10% X7R 无极性电容 C4532; Package: C1210
CA1 CB1 = 0603 1uF (105) 10% 50V: 贴片电容; ComponentLink1Description: 供应商链接; ComponentLink1URL: http://www.szlcsc.com/product/details_16531.html; Package: 0603; Supplier: LC; SuppliersPartNumber: C15849
CA2 = 0402 47pF (470) 5% 50V: 贴片电容; ComponentLink1Description: 供应商链接; ComponentLink1URL: http://www.szlcsc.com/product/details_1919.html; Package: 0402; Supplier: LC; SuppliersPartNumber: C1567
CA3 CA4 CB3 CB4 = 1206 10uF (106) 10% 50V: 贴片电容; ComponentLink1Description: 供应商链接; ComponentLink1URL: http://www.szlcsc.com/product/details_14236.html; Package: 1206; Supplier: LC; SuppliersPartNumber: C13585
CB2 = 0402 33pF (330) 5% 50V: 贴片电容; ComponentLink1Description: 供应商链接; ComponentLink1URL: http://www.szlcsc.com/product/details_1914.html; Package: 0402; Supplier: LC; SuppliersPartNumber: C1562
CI1 CQ19 = 0603 100nF (104) 10% 50V: 贴片电容; ComponentLink1Description: 供应商链接; ComponentLink1URL: http://www.szlcsc.com/product/details_15331.html; Package: 0603; Supplier: LC; SuppliersPartNumber: C14663
CQ1-CQ18 = C: val: 贴片电容10UF 100V 1210 106K 10% X7R 无极性电容10UF C3225陶瓷; Package: C1210
CU1-2 CU3-4 CU5-6 CU7-8 CU9-10 CU11-12 CU13-14 CU15-16 CU17-18 CU24 = 0805 1uF (105) 10% 50V: 贴片电容; ComponentLink1Description: 供应商链接; ComponentLink1URL: http://www.szlcsc.com/product/details_29074.html; Package: 0805; Supplier: LC; SuppliersPartNumber: C28323
D1-2 D3-4 D5-6 D7-8 D9-10 D11-12 D13-14 D15-16 D17-18 = LL-34 ZMM5V6: 稳压二极管; ComponentLink1Description: 供应商链接; ComponentLink1URL: http://www.szlcsc.com/product/details_119974.html; Package: LL-34; Supplier: LC; SuppliersPartNumber: C118707; VAL: ZMM5255B
DP1-DP18 = Diode: SB1045L-TO-277超低功耗肖特基二极管; Package: TO-277B
DX_1-DX_17 = D: Package: DO-214AB(2114)/SMC; VAL: US5M
DX_18 = D: 超快恢复二极管; Package: DO-214AB(2114)/SMC; VAL: US5M
ESD1-ESD4 = SRV05-4-P-T7_[C85364]: TVS; ComponentLink1Description: 供应商链接; ComponentLink1URL: http://www.szlcsc.com/product/details_86537.html; Package: SOT-23-6; Supplier: LC; SuppliersPartNumber: C85364
JR = Header 13X2: Header, 13-Pin, Dual row
LA1 = 1206 4.7uH  10%: 贴片电感; ComponentLink1Description: 供应商链接; ComponentLink1URL: http://www.szlcsc.com/product/details_1401.html; Package: 1206; Supplier: LC; SuppliersPartNumber: C1049
LB1 = 1206 10uH 10%: 贴片电感; ComponentLink1Description: 供应商链接; ComponentLink1URL: http://www.szlcsc.com/product/details_1403.html; Package: 1206; Supplier: LC; SuppliersPartNumber: C1051
LED_01 LED_02 LED_03 LED_04 LED_05 LED_06 LED_07 LED_08 LED_09-LED_20 = LED_R: 发光二极管; ComponentLink1Description: 供应商链接; ComponentLink1URL: http://www.szlcsc.com/product/details_2659.html; Package: 0603; Supplier: LC; SuppliersPartNumber: C2286
P24_O = Header 4: Header, 4-Pin; LatestRevisionDate: 17-Jul-2002; LatestRevisionNote: Re-released for DXP Platform.; Publisher: Altium Limited
P_OUT = Header 12X2: Header, 12-Pin, Dual row
PWR = Header 4: 2W2公90度带支架锁螺丝; ComponentLink1Description: 供应商链接; ComponentLink1URL: https://detail.tmall.com/item.htm?id=558445080450&spm=a1z09.2.0.0.5d8f2e8d4CXB2z&_u=i102dhvu7ca9
QP1-QP20 = NMOS-2: N-Channel Power MOSFET; VAL: STB120NF10; ComponentLink1Description: 供应商链接; ComponentLink1URL: http://www.st.com/content/st_com/en/products/power-transistors/power-mosfets/n-channel-stripfet-gt-30-v-to-350-v/stb120nf10.html
R1 R4 R7 R10 R13 R16 R19 R22 R25 R28 R31 R34 R37 R40 R43 R46 = 0402 1KΩ (1001) 1%: 贴片电阻; ComponentLink1Description: 供应商链接; ComponentLink1URL: http://www.szlcsc.com/product/details_12256.html; Package: 0402; Supplier: LC; SuppliersPartNumber: C11702
R1-2 R3-4 R5-6 R7-8 R9-10 R11-12 R13-14 R15-16 R17-18 = 0805 1KΩ (1001) 1%: 贴片电阻; ComponentLink1Description: 供应商链接; ComponentLink1URL: http://www.szlcsc.com/product/details_18201.html; Package: 0805; Supplier: LC; SuppliersPartNumber: C17513
R2 R5 R8 R11 R14 R17 R20 R23 R26 R29 R32 R35 R38 R41 R44 R47 = 0402 15KΩ (1502) 1%: 贴片电阻; ComponentLink1Description: 供应商链接; ComponentLink1URL: http://www.szlcsc.com/product/details_26499.html; Package: 0402; Supplier: LC; SuppliersPartNumber: C25756
R3 R6 R9 R12 R15 R18 R21 R24 R27 R30 R33 R36 R39 R42 R45 R48 RA1 RB1 = 0402 100KΩ (1003) 1%: 贴片电阻; ComponentLink1Description: 供应商链接; ComponentLink1URL: http://www.szlcsc.com/product/details_26484.html; Package: 0402; Supplier: LC; SuppliersPartNumber: C25741
R_J5V RA8 RB8 = 0805 0Ω (0R0) 1%: 贴片电阻; ComponentLink1Description: 供应商链接; ComponentLink1URL: http://www.szlcsc.com/product/details_18165.html; Package: 0805; Supplier: LC; SuppliersPartNumber: C17477
RA2 RB2 = 0402 120KΩ (1203) 1%: 贴片电阻; ComponentLink1Description: 供应商链接; ComponentLink1URL: http://www.szlcsc.com/product/details_26493.html; Package: 0402; Supplier: LC; SuppliersPartNumber: C25750
RA3 RB3 = 0402 3.9KΩ(3901) 1%: 贴片电阻; ComponentLink1Description: 供应商链接; ComponentLink1URL: http://www.szlcsc.com/product/details_52734.html; Package: 0402; Supplier: LC; SuppliersPartNumber: C51721
RA4 RB4 = 0402 100Ω (1000) 1%: 贴片电阻; ComponentLink1Description: 供应商链接; ComponentLink1URL: http://www.szlcsc.com/product/details_25819.html; Package: 0402; Supplier: LC; SuppliersPartNumber: C25076
RA5 = 0402 22KΩ (2202) 1%: 贴片电阻; ComponentLink1Description: 供应商链接; ComponentLink1URL: http://www.szlcsc.com/product/details_26511.html; Package: 0402; Supplier: LC; SuppliersPartNumber: C25768
RA6 = 0402 1.5KΩ (1501) 1%: 贴片电阻; ComponentLink1Description: 供应商链接; ComponentLink1URL: http://www.szlcsc.com/product/details_26610.html; Package: 0402; Supplier: LC; SuppliersPartNumber: C25867
RA7 = 0402 200Ω (2000) 1%: 贴片电阻; ComponentLink1Description: 供应商链接; ComponentLink1URL: http://www.szlcsc.com/product/details_25830.html; Package: 0402; Supplier: LC; SuppliersPartNumber: C25087
RB5 = 0402 5.1KΩ (5101) 1%: 贴片电阻; ComponentLink1Description: 供应商链接; ComponentLink1URL: http://www.szlcsc.com/product/details_26648.html; Package: 0402; Supplier: LC; SuppliersPartNumber: C25905
RB6 = 0402 3.3KΩ (3301) 1%: 贴片电阻; ComponentLink1Description: 供应商链接; ComponentLink1URL: http://www.szlcsc.com/product/details_26633.html; Package: 0402; Supplier: LC; SuppliersPartNumber: C25890
RB7 = 0402 470Ω (4700) 1%: 贴片电阻; ComponentLink1Description: 供应商链接; ComponentLink1URL: http://www.szlcsc.com/product/details_25860.html; Package: 0402; Supplier: LC; SuppliersPartNumber: C25117
RI1-RI5 = 0402 10KΩ (1002) 1%: 贴片电阻; ComponentLink1Description: 供应商链接; ComponentLink1URL: http://www.szlcsc.com/product/details_26487.html; Package: 0402; Supplier: LC; SuppliersPartNumber: C25744
RI6-RI9 = 0402 0Ω (0R0) 1%: 贴片电阻; ComponentLink1Description: 供应商链接; ComponentLink1URL: http://www.szlcsc.com/product/details_17853.html; Package: 0402; Supplier: LC; SuppliersPartNumber: C17168
RL_01 RL_02 RL_03 RL_04 RL_05 RL_06 RL_07 RL_08 RL_09-RL_20 = 0603 20KΩ (2002) 1%: 贴片电阻; VAL: 20KΩ_±1%; ComponentLink1Description: 供应商链接; ComponentLink1URL: http://www.szlcsc.com/product/details_4591.html; Package: 0603; Supplier: LC; SuppliersPartNumber: C4184
RP1-4 RP5-8 RP9-12 RP13-16 RP17-20 = 0603*4  10KΩ (103) 5%: 贴片排阻; ComponentLink1Description: 供应商链接; ComponentLink1URL: http://www.szlcsc.com/product/details_30472.html; Package: 0603*4; Supplier: LC; SuppliersPartNumber: C29718
RQ1-RQ18 = R: 贴片合金电阻; Package: R2512; VAL: 0.01Ω(R010) ±1% 1W; ComponentLink1Description: 供应商链接; ComponentLink1URL: http://www.szlcsc.com/product/details_106578.html; Supplier: LC; SuppliersPartNumber: C105363
SA1 SB1 = D Zener: TVS
TVS = SMA(DO-214AC) US1M: 二极管; ComponentLink1Description: 供应商链接; ComponentLink1URL: http://www.szlcsc.com/product/details_5885.html; Package: SMA(DO-214AC); Supplier: LC; SuppliersPartNumber: C5441
U1-2 = LTC1255: 24V双路高侧NMOS驱动IC; VAL: LTC1255CS8; ComponentLink1Description: 官网链接; ComponentLink1URL: http://www.linear.com.cn/product/ltc1255
U3-4 U5-6 U7-8 U9-10 U11-12 U13-14 U15-16 U17-18 = LTC1255: VAL: LTC1255CS8; ComponentLink1Description: 官网链接; ComponentLink1URL: http://www.linear.com.cn/product/ltc1255
U-05 U-12 = BL9342: 40V, 600mA , Step-Down Converter,DC-DC芯片; SuppliersPartNumber: C93176; ComponentLink1URL: https://item.szlcsc.com/94371.html; Package: SOT-23-6
UIO = MCP23017-E/SO: 16-Bit I/O Expander with Serial Interface
ZD1-ZD20 = Zener Diode: Surface Mount Zener Diodes; VAL: LBZT52C2V4T1G Series; ComponentLink1URL: http://www.szlcsc.com/product/details_13388.html; SuppliersPartNumber: C12747; Package: SOD-123; Supplier: LC; ComponentLink1Description: 供应商链接
ZM01 ZM02 ZM03 ZM04 ZM05 ZM06 ZM07 ZM08 ZM09-ZM16 = LL-34 ZMM3V3: 稳压二极管; ComponentLink1Description: 供应商链接; ComponentLink1URL: http://www.szlcsc.com/product/details_8535.html; Package: LL-34; Supplier: LC; SuppliersPartNumber: C8056